# Altium project x.test - Demo Board.PrjPcb
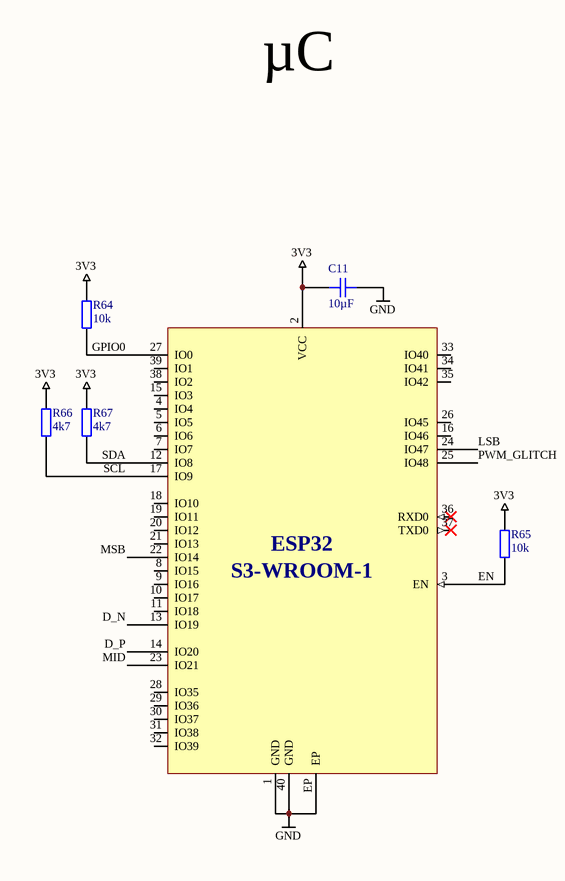
[diagram p0: Demo Board 4 - Schematic.SchDoc]
1 sheet, 6 parts. Net scope: global (net labels, ports and power ports of the same name join across sheets).
Board file: Demo Board - PCB.PcbDoc

## Sheet Demo Board 4 - Schematic.SchDoc
size A4; SheetNumber: 4; SheetTotal: 4

### Parts
C11  10µF  [CAP_0805]
R64  10k  [RES_0603]
R65  10k  [RES_0603]
R66  4k7  [RES_0603]
R67  4k7  [RES_0603]
U3  ESP32-S3-WROOM-1-N8  [ESP32-S3-WROOM-1]  (value not drawn)

### Nets
3V3: C11.2 R64.2 R65.2 R66.2 R67.2 U3.2(VCC)
GND: C11.1 U3.1(GND) U3.40(GND) U3.EP
D_N: U3.13(IO19)
D_P: U3.14(IO20)
EN: R65.1 U3.3(EN)
GPIO0: R64.1 U3.27(IO0)
LSB: U3.24(IO47)
MID: U3.23(IO21)
MSB: U3.22(IO14)
PWM_GLITCH: U3.25(IO48)
SCL: R66.1 U3.17(IO9)
SDA: R67.1 U3.12(IO8)

Not connected (* = marked no-connect by the designer): U3 4(IO4) 5(IO5) 6(IO6) 7(IO7) 8(IO15) 9(IO16) 10(IO17) 11(IO18) 15(IO3) 16(IO46) 18(IO10) 19(IO11) 20(IO12) 21(IO13) 26(IO45) 28(IO35) 29(IO36) 30(IO37) 31(IO38) 32(IO39) 33(IO40) 34(IO41) 35(IO42) 36(RXD0)* 37(TXD0)* 38(IO2) 39(IO1)

### Notes on the sheet
- µC
- (in symbol ESP32-S3-WROOM-1-N4) ESP32; S3-WROOM-1

### Library data of the parts
C11 = CAP_0805: Capacitor SMD 0805; Manufacturer: *; Manufacturer Part Number: *; Distributor Link: *; LCSC: *; Rating: *; Dielectric: *
R64-R67 = RES_0603: Resistor SMD 0603; Manufacturer: *; Manufacturer Part Number: *; Distributor Link: *; LCSC: *
U3 = ESP32-S3-WROOM-1-N4: 2.4 GHz Wi-Fi (802.11 b/g/n) and Bluetooth 5 (LE) Module ESP32-S3, 4MB Flash, on-board PCB antenna); Manufacturer: Espressif; Manufacturer Part Number: ESP32-S3-WROOM-1-N4; Distributor Link: https://www.mouser.de/ProductDetail/Espressif-Systems/ESP32-S3-WROOM-1-N4?qs=Li%252BoUPsLEnsO%2FkiJOUK0FQ%3D%3D